# Altium schematic sheet keypad.SchDoc
size A
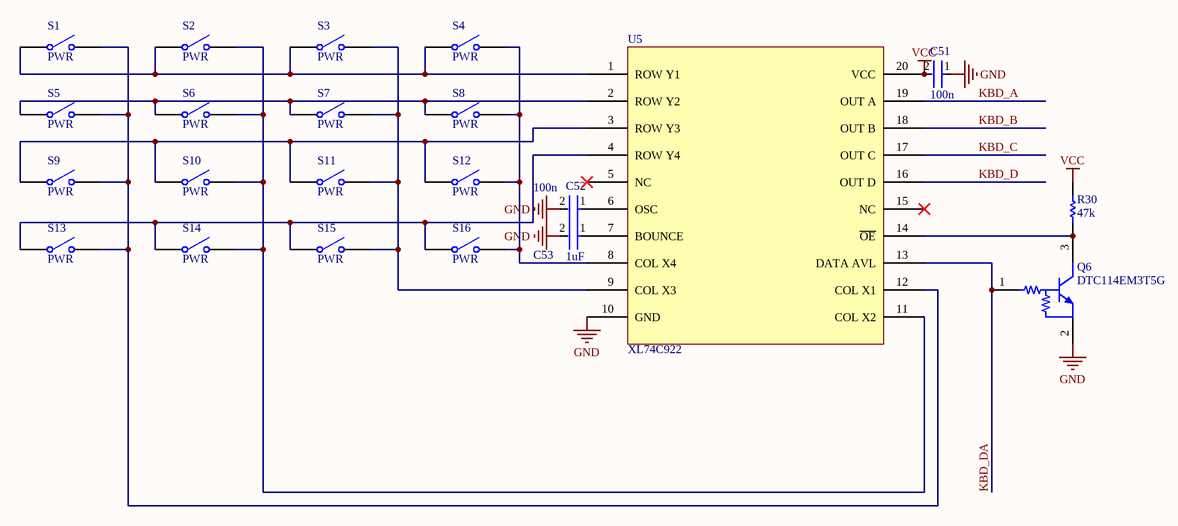
[diagram p0: keypad.SchDoc]

## Parts
C51  100n  [FP-GRM155-0_05-IPC_A]
C52  100n  [FP-GRM188-0_1-e0_2_0_55-IPC_A]
C53  1uF  [FP-GRM188-0_1-e0_2_0_55-IPC_A]
Q6  DTC114EM3T5G  [ONSC-SOT-723-3-631AA-01_V]
R30  47k  [RESC1005X40X25NL05T10]
S1  PWR  [3-6-2.5]
S2  PWR  [3-6-2.5]
S3  PWR  [3-6-2.5]
S4  PWR  [3-6-2.5]
S5  PWR  [3-6-2.5]
S6  PWR  [3-6-2.5]
S7  PWR  [3-6-2.5]
S8  PWR  [3-6-2.5]
S9  PWR  [3-6-2.5]
S10  PWR  [3-6-2.5]
S11  PWR  [3-6-2.5]
S12  PWR  [3-6-2.5]
S13  PWR  [3-6-2.5]
S14  PWR  [3-6-2.5]
S15  PWR  [3-6-2.5]
S16  PWR  [3-6-2.5]
U5  XL74C922  [XL74C922]

## Nets
GND: C51.1 C52.2 C53.2 Q6.2(E) U5.10(GND)
VCC: C51.2 R30.2 U5.20(VCC)
KBD_A: U5.19(OUT_A)
KBD_B: U5.18(OUT_B)
KBD_C: U5.17(OUT_C)
KBD_D: U5.16(OUT_D)
KBD_DA: Q6.1(B) U5.13(DATA_AVL)
NetC52_1: C52.1 U5.6(OSC)
NetC53_1: C53.1 U5.7(BOUNCE)
NetQ6_3: Q6.3(C) R30.1 U5.14(~{OE})
NetS1_1: S1.1(COMMON) S2.1(COMMON) S3.1(COMMON) S4.1(COMMON) U5.1(ROW_Y1)
NetS1_2: S1.2(NO) S5.2(NO) S9.2(NO) S13.2(NO) U5.12(COL_X1)
NetS2_2: S2.2(NO) S6.2(NO) S10.2(NO) S14.2(NO) U5.11(COL_X2)
NetS3_2: S3.2(NO) S7.2(NO) S11.2(NO) S15.2(NO) U5.9(COL_X3)
NetS4_2: S4.2(NO) S8.2(NO) S12.2(NO) S16.2(NO) U5.8(COL_X4)
NetS5_1: S5.1(COMMON) S6.1(COMMON) S7.1(COMMON) S8.1(COMMON) U5.2(ROW_Y2)
NetS9_1: S9.1(COMMON) S10.1(COMMON) S11.1(COMMON) S12.1(COMMON) U5.3(ROW_Y3)
NetS13_1: S13.1(COMMON) S14.1(COMMON) S15.1(COMMON) S16.1(COMMON) U5.4(ROW_Y4)

Not connected (* = marked no-connect by the designer): U5 5(NC)* 15(NC)*

## Library data of the parts
C51 = CMP-2008-04369-2: Chip Multilayer Ceramic Capacitors for General Purpose, 0402, 470pF, C0G, 30ppm/°C, 5%, 50V; Insulation Resistance: 10GR; Depth: 0.5mm; Voltage Rating: 50V; Packaging: Tape and Reel; Material: Ceramic; Lead Free: Lead Free; Max Operating Temperature: 125°C; Length: 1mm; Min Operating Temperature: -55°C; Height: 0.5mm; Width: 0.5mm; Thickness: 0.022inch; Voltage: 50V; Termination: SMD/SMT; Dielectric Material: Ceramic; REACH SVHC: No SVHC; Voltage Rating (DC): 50V; Package Quantity: 1; Dielectric: C0G; Radiation Hardening: No; Mount: Surface Mount; Case/Package: 0402; Number of Pins: 2; Tolerance: 5%; Temperature Coefficient: 30ppm/°C; Case Code (Metric): 1005; Capacitance: 470pF; Case Code (Imperial): 0402
C52 C53 = CMP-2006-02792-2: Chip Multilayer Ceramic Capacitors for General Purpose, 0603, 10uF, X5R, 15%, 20%, 6.3V; Packaging: Tape and Reel; Voltage Rating (DC): 6.3V; Width: 0.031inch; Termination: SMD/SMT; Dielectric: X5R; Package Quantity: 4000; Voltage Rating: 6.3V; Capacitance: 10uF; Case/Package: 0603; Min Operating Temperature: -55°C; Voltage: 6.3V; Length: 1.6mm; Thickness: 0.035inch; Lead Free: Lead Free; Depth: 0.8mm; Case Code (Imperial): 0603; Max Operating Temperature: 85°C; Material: Ceramic; Height: 0.8mm; Tolerance: 20%; Mount: Surface Mount; REACH SVHC: No SVHC; Radiation Hardening: No; Case Code (Metric): 1608
Q6 = CMP-0630-00443-1: Digital Transistor (BRT), R1=10 kOhm, R2=10 kOhm, NPN Transistor, 3-Pin SOT-723, Pb-Free, Tape and Reel; Manufacturer: On Semiconductor; V(BR)CEO Min (V): 50; R1/R2 Typ: 1; IC Continuous (A): 0.1; hFE Min: 35; ComponentLink3Description: Package Specification; Packing: Tape and Reel; ComponentLink1Description: Manufacturer URL; DatasheetVersion: Rev. 5; PackageDescription: 3-Pin Small Outline Transistor, Body 1.2 x 0.8 mm, Pitch 0.4 mm; RoHS: TRUE; Mounting Technology: Surface Mount; ComponentLink2URL: http://www.onsemi.cn/pub_link/Collateral/DTC114E-D.PDF; ComponentLink2Description: Datasheet; ComponentLink1URL: http://www.onsemi.com/; Polarity: NPN; PackageVersion: Rev. D, 08/2009; PartNumber: DTC114EM3T5G; PackageReference: SOT-723-3-631AA-01; ComponentLink3URL: http://www.onsemi.com/pub_link/Collateral/631AA.PDF
R30 = CMP-1011-00001-2: Manufacturer: Yageo / Phycomp; Part Number: RC0402JR-070RL
S1-S16 = SW-SPST: Single-Pole, Single-Throw Switch; Published: 24-Mar-1999; LatestRevisionDate: 17-Jul-2002; LatestRevisionNote: Re-released for DXP Platform.; PackageReference: SPST-2; Publisher: Altium Limited; PackageDescription: Switch; 2 Leads